# Altium schematic sheet Glucometer-I.C.- Tests Full V1.SchDoc
size A4; PageSetup: Record=PageOptions|CenterHorizontal=True|CenterVertical=True|PrintScale=0.91|XCorrection=1.00|YCorrection=1.00|PrintKind=1|BorderSize=5000000|LeftOffset=0|BottomOffset=0|Orientation=2|PaperLength=1000|PaperWidth=1000|Scale=100|PaperSource=7|PrintQuality=-4|MediaType=1|DitherType=10|PaperKind=Carta|PrintScaleMode=1
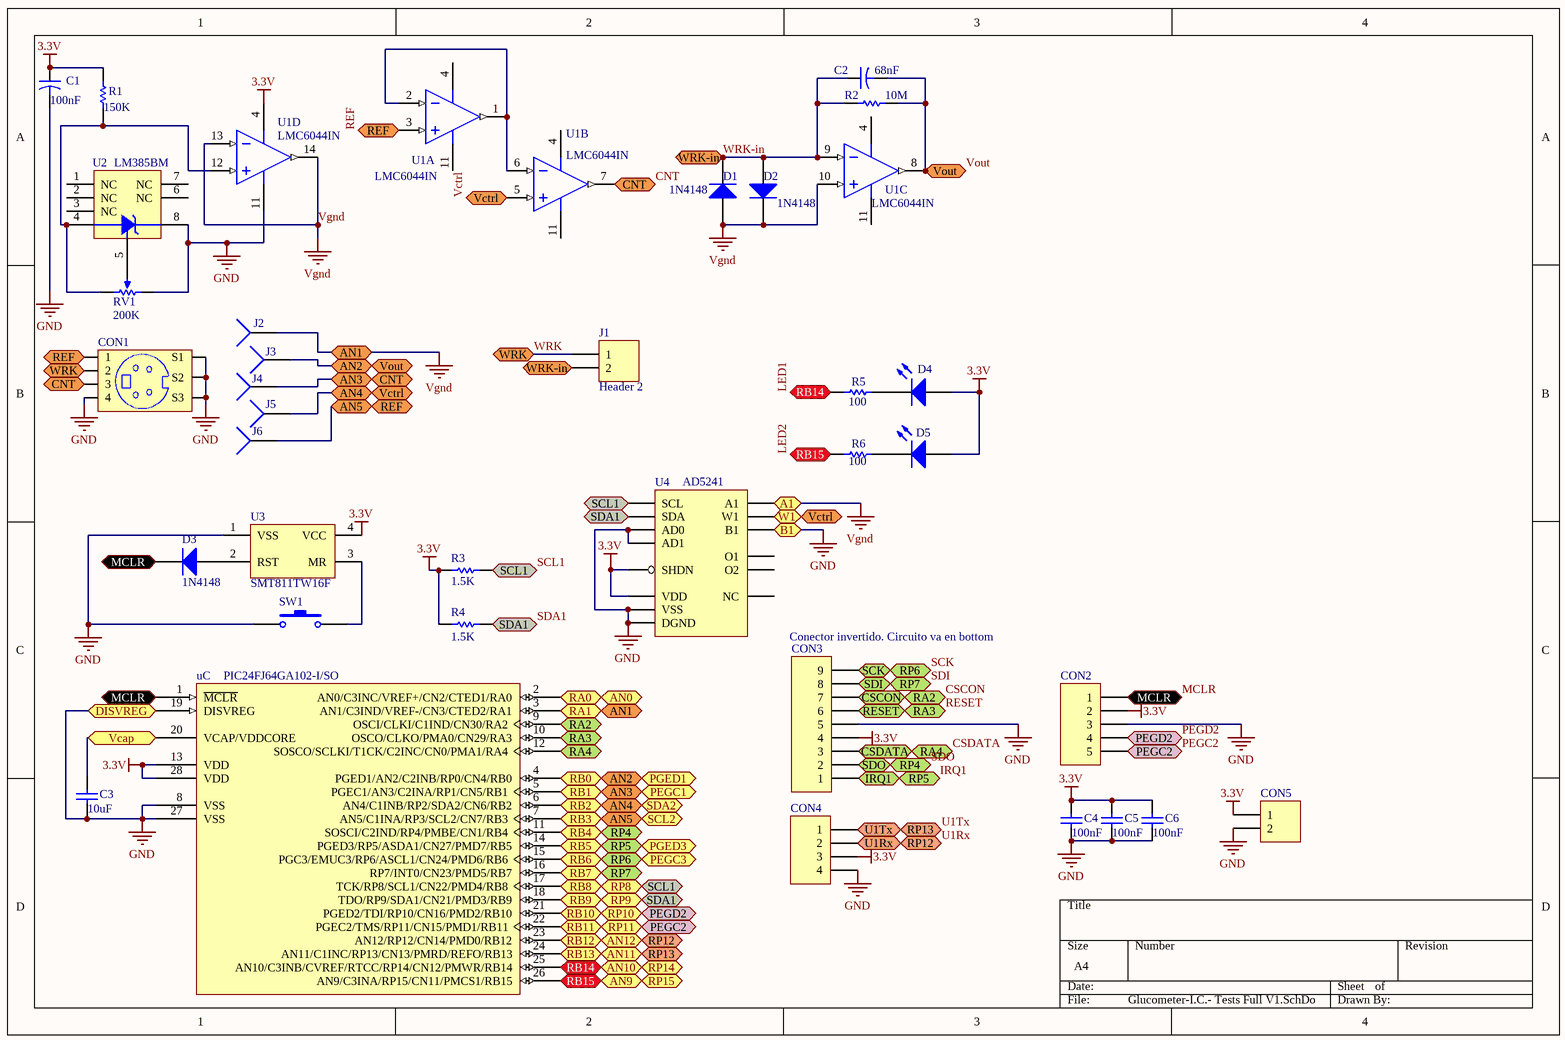
[diagram p0: Glucometer-I.C.- Tests Full V1.SchDoc]

## Parts
C1  value 100nF  [CAPC1608N]  (hidden comment: Cap2)
C2  value 68nF  [CAPC1608N]  (hidden comment: Cap2)
C3  value 10uF  [CAPC2012N]  (hidden comment: Cap)
C4  value 100nF  [CAPC1608N]  (hidden comment: Cap)
C5  value 100nF  [CAPC1608N]  (hidden comment: Cap)
C6  value 100nF  [CAPC1608N]  (hidden comment: Cap)
CON1  (no value)  [CDIN2.6-3H4A]
CON2  Header 5  [HDR1X5]  (value not drawn)
CON3  Header 9  [HDR1X9]  (value not drawn)
CON4  Header 4  [HDR1X4]  (value not drawn)
CON5  Header 2  [HDR1X2]  (value not drawn)
D1  1N4148  [CD3216-1206]
D2  1N4148  [CD3216-1206]
D3  1N4148  [DO-35]
D4  LED2  [3.2X1.6X1.1]  (value not drawn)
D5  LED2  [3.2X1.6X1.1]  (value not drawn)
J1  Header 2  [HDR1X2]
J2  Socket  [PIN1]  (value not drawn)
J3  Socket  [PIN1]  (value not drawn)
J4  Socket  [PIN1]  (value not drawn)
J5  Socket  [PIN1]  (value not drawn)
J6  Socket  [PIN1]  (value not drawn)
R1  value 150K  [RESC2012N]  (hidden comment: Res1)
R2  value 10M  [RESC2012N]  (hidden comment: Res1)
R3  value 1.5K  [RESC2012N]  (hidden comment: Res1)
R4  value 1.5K  [RESC2012N]  (hidden comment: Res1)
R5  value 100  [RESC2012N]  (hidden comment: Res1)
R6  value 100  [RESC2012N]  (hidden comment: Res1)
RV1  value 200K  [SOT23-3N]  (hidden comment: RPot)
SW1  SW-PB  [SPST-2]  (value not drawn)
U1  LMC6044IN  [M14A_N]  (parts A,B,C,D of 4)
U2  LM385BM  [M08A_N]
U3  SMT811TW16F  [SOT143]
U4  AD5241  [R-14_N]
uC  PIC24FJ64GA102-I/SO  [SOIC-SO28_N]

## Ports
A1, AN0, AN1, AN2, AN3, AN4, AN5, AN9, AN10, AN11, AN12, B1, CNT, CSCON, CSDATA, DISVREG, IRQ1, MCLR, PEGC1, PEGC2, PEGC3, PEGD2, PGED1, PGED3, RA0, RA1, RA2, RA3, RA4, RB0, RB1, RB2, RB3, RB4, RB5, RB6, RB7, RB8, RB9, RB10, RB11, RB12, RB13, RB14, RB15, REF, RESET, RP4, RP5, RP6, RP7, RP8, RP9, RP10, RP11, RP12, RP13, RP14, RP15, SCK, SCL1, SCL2, SDA1, SDA2, SDI, SDO, U1Rx, U1Tx, Vcap, Vctrl, Vout, W1, WRK, WRK-in

## Nets
3.3V: C1.1 C4.2 C5.2 C6.2 CON2.2 CON3.4 CON4.3 CON5.1 D4.1(A) D5.1(A) R1.2 R3.1 R4.1 U1.4(V+) U3.4(VCC) U4.4(VDD) U4.5(SHDN) uC.13(VDD) uC.28(VDD)
GND: C1.2 C3.1 C4.1 C5.1 C6.1 CON1.4 CON1.MH1(S1) CON1.MH2(S2) CON1.MH3(S3) CON2.3 CON3.5 CON4.4 CON5.2 RV1.1(TOP) SW1.1 U1.11(V-) U2.8(+V) U3.1(VSS) U4.3(B1) U4.8(AD0) U4.9(AD1) U4.10(DGND) U4.11(VSS) uC.8(VSS) uC.19(DISVREG) uC.27(VSS) ; port DISVREG, port B1
Vgnd: D1.1(A) D2.2(K) J2.1 U1.10(IN3+) U1.13(IN4-) U1.14(OUT4) U4.1(A1) uC.3(AN1/C3IND/VREF-/CN3/CTED2/RA1) ; port RA1, port AN1, port A1
AN0: uC.2(AN0/C3INC/VREF+/CN2/CTED1/RA0) ; port RA0, port AN0
CNT: CON1.3 J4.1 U1.7(OUT2) uC.5(PGEC1/AN3/C2INA/RP1/CN5/RB1) ; port CNT, port RB1, port AN3, port PEGC1
CSCON: CON3.7 uC.9(OSCI/CLKI/C1IND/CN30/RA2) ; port CSCON, port RA2
CSDATA: CON3.3 uC.12(SOSCO/SCLKI/T1CK/C2INC/CN0/PMA1/RA4) ; port RA4, port CSDATA
IRQ1: CON3.1 uC.14(PGED3/RP5/ASDA1/CN27/PMD7/RB5) ; port RP5, port PGED3, port RB5, port IRQ1
LED1: R5.1 uC.25(AN10/C3INB/CVREF/RTCC/RP14/CN12/PMWR/RB14) ; port RB14, port AN10, port RP14
LED2: R6.1 uC.26(AN9/C3INA/RP15/CN11/PMCS1/RB15) ; port RB15, port AN9, port RP15
MCLR: CON2.1 D3.2(K) uC.1(~{MCLR}) ; port MCLR
PEGC2: CON2.5 uC.22(PGEC2/TMS/RP11/CN15/PMD1/RB11) ; port RB11, port RP11, port PEGC2
PEGD2: CON2.4 uC.21(PGED2/TDI/RP10/CN16/PMD2/RB10) ; port RB10, port RP10, port PEGD2
REF: CON1.1 J6.1 U1.3(IN1+) uC.7(AN5/C1INA/RP3/SCL2/CN7/RB3) ; port REF, port RB3, port AN5, port SCL2
RESET: CON3.6 uC.10(OSCO/CLKO/PMA0/CN29/RA3) ; port RA3, port RESET
SCK: CON3.9 uC.15(PGC3/EMUC3/RP6/ASCL1/CN24/PMD6/RB6) ; port RP6, port PEGC3, port SCK, port RB6
SCL1: R3.2 U4.6(SCL) uC.17(TCK/RP8/SCL1/CN22/PMD4/RB8) ; port RB8, port SCL1, port RP8
SDA1: R4.2 U4.7(SDA) uC.18(TDO/RP9/SDA1/CN21/PMD3/RB9) ; port RB9, port SDA1, port RP9
SDI: CON3.8 uC.16(RP7/INT0/CN23/PMD5/RB7) ; port RP7, port SDI, port RB7
SDO: CON3.2 uC.11(SOSCI/C2IND/RP4/PMBE/CN1/RB4) ; port SDO, port RB4, port RP4
U1Rx: CON4.2 uC.23(AN12/RP12/CN14/PMD0/RB12) ; port RB12, port AN12, port RP12, port U1Rx
U1Tx: CON4.1 uC.24(AN11/C1INC/RP13/CN13/PMRD/REFO/RB13) ; port RB13, port AN11, port RP13, port U1Tx
Vcap: C3.2 uC.20(VCAP/VDDCORE) ; port Vcap
Vctrl: J5.1 U1.5(IN2+) U4.2(W1) uC.6(AN4/C1INB/RP2/SDA2/CN6/RB2) ; port Vctrl, port RB2, port AN4, port SDA2, port W1
Vout: C2.2 J3.1 R2.1 U1.8(OUT3) uC.4(PGED1/AN2/C2INB/RP0/CN4/RB0) ; port Vout, port RB0, port AN2, port PGED1
WRK: CON1.2 J1.1 ; port WRK
WRK-in: C2.1 D1.2(K) D2.1(A) J1.2 R2.2 U1.9(IN3-) ; port WRK-in
NetD3_1: D3.1(A) U3.2(RST)
NetD4_2: D4.2(K) R5.2
NetD5_2: D5.2(K) R6.2
NetR1_1: R1.1 RV1.2(BOT) U1.12(IN4+) U2.4(-V)
NetRV1_3: RV1.3(TAP) U2.5(FB)
NetSW1_2: SW1.2 U3.3(MR)
NetU1_1: U1.1(OUT1) U1.2(IN1-) U1.6(IN2-)

Not connected (* = marked no-connect by the designer): U2 1(NC) 2(NC) 3(NC) 6(NC) 7(NC); U4 12(O2) 13(NC) 14(O1)

## Notes on the sheet
- Conector invertido. Circuito va en bottom

## Library data of the parts
C1 C2 = Cap2: Capacitor; Published: 23-Sep-2002; PackageReference: CAPR5-4X5; Publisher: Altium Limited; PackageDescription: Capacitor; 2 Leads
C3-C6 = Cap: Capacitor; Published: 8-Jun-2000; LatestRevisionDate: 17-Jul-2002; LatestRevisionNote: Re-released for DXP Platform.; PackageReference: RAD-0.3; Publisher: Altium Limited; PackageDescription: Radial Cap, Thru-Hole; 2 Leads; 0.3 in Pin Spacing
CON1 = MiniDin 4Pins - SuperVideo: MiniDin 4 Pins
CON2 = Header 5: Header, 5-Pin; LatestRevisionDate: 17-Jul-2002; LatestRevisionNote: Re-released for DXP Platform.; Publisher: Altium Limited
CON3 = Header 9: Header, 9-Pin; LatestRevisionDate: 17-Jul-2002; LatestRevisionNote: Re-released for DXP Platform.; Publisher: Altium Limited
CON4 = Header 4: Header, 4-Pin; LatestRevisionDate: 17-Jul-2002; LatestRevisionNote: Re-released for DXP Platform.; Publisher: Altium Limited
CON5 J1 = Header 2: Header, 2-Pin; LatestRevisionDate: 17-Jul-2002; LatestRevisionNote: Re-released for DXP Platform.; Publisher: Altium Limited
D1-D3 = 1N4148: High Conductance Fast Diode; Published: 8-Jun-2000; LatestRevisionDate: 17-Jul-2002; LatestRevisionNote: Re-released for DXP Platform.; DatasheetDocument: 1997; PackageReference: DO-35; Publisher: Altium Limited; Code_JEDEC: DO-204-AH; ComponentLink1Description: Manufacturer Link; ComponentLink1URL: http://www.fairchildsemi.com/; ComponentLink2Description: Datasheet; ComponentLink2URL: http://www.fairchildsemi.com/ds/1N%2F1N4148.pdf
D4 D5 = LED2: Typical RED, GREEN, YELLOW, AMBER GaAs LED; Published: 8-Jun-2000; LatestRevisionDate: 17-Jul-2002; LatestRevisionNote: Re-released for DXP Platform.; PackageVersion: Feb-2002; PackageReference: 3.2X1.6X1.1; Publisher: Altium Limited; PackageDescription: SM LED; 2 Flat Leads
R1-R6 = Res1: Resistor; Published: 8-Jun-2000; LatestRevisionDate: 17-Jul-2002; LatestRevisionNote: Re-released for DXP Platform.; PackageReference: AXIAL-0.3; Publisher: Altium Limited; PackageDescription: Axial Device, Thru-Hole; 2 Leads; 0.3 in Pin Spacing
RV1 = RPot: Potentiometer; pin to pad: 2>3 3>2; Sim Note: Enter the Resistance value and the set point into parameter fields.; Set Position: 0.5; Published: 8-Jun-2000; LatestRevisionDate: 17-Jul-2002; LatestRevisionNote: Re-released for DXP Platform.; PackageReference: VR5; Publisher: Altium Limited; PackageDescription: Variable Resistor, Thru-Hole; 3 Leads
SW1 = SW-PB: Switch; Published: 24-Mar-1999; LatestRevisionDate: 17-Jul-2002; LatestRevisionNote: Re-released for DXP Platform.; PackageReference: SPST-2; Publisher: Altium Limited; PackageDescription: Switch; 2 Leads
U1 = LMC6044IN: CMOS Quad Micropower Operational Amplifier, 14-pin MDIP; Manufacturer: National Semiconductor; PackageTopMarking: NSUZXYYTTE#*LMC6044IN; PowerWise: Y; CompType: Amplifiers; Published: 4-Dec-2008; LatestRevisionDate: 13-Jan-2009; LatestRevisionNote: Sim Model Added.; DatasheetVersion: Aug-2000; PackageVersion: revG, May-2006; PackageReference: N14A; Publisher: Altium Limited; PackageDescription: MDIP, .750 x .250 x.130in, 14 Lead, .100in Pitch; Supplier 1: Farnell; Supplier Part Number 1: 9494634; PartNumber: LMC6044IN; RoHS: N; PinCount: 14; Code_JEDEC: MS-001-AA; ComponentLink1Description: LMC6044 Datasheet; ComponentLink1URL: http://www.national.com/ds/LM/LMC6044.pdf; ComponentLink2Description: LMC6044 Web Page; ComponentLink2URL: http://www.national.com/pf/LM/LMC6044.html; ComponentLink3Description: N14A Package Page; ComponentLink3URL: http://www.national.com/packaging/folders/n14a.html
U2 = LM385BM: Adjustable Micropower Voltage Reference, 8-pin Narrow SOIC; Manufacturer: National Semiconductor; PackageTopMarking: NSZXTT*LM385*BM; PowerWise: N; CompType: Voltage Reference IC; Published: 4-Dec-2008; DatasheetVersion: Jan-2008; PackageVersion: revM, May-2009; PackageReference: M08A; Publisher: Altium Limited; PackageDescription: SOIC Narrow, 4.9 x 3.9 x 1.45mm, 8 Lead, 1.27mm Pitch; Supplier 1: Farnell; Supplier Part Number 1: 953817; PartNumber: LM385BM; RoHS: N; PinCount: 8; Code_JEDEC: MS-012-AA; Code_IPC: SOIC127P600-8; ComponentLink1Description: LM385-ADJ Datasheet; ComponentLink1URL: http://www.national.com/ds/LM/LM385-ADJ.pdf; ComponentLink2Description: LM385-ADJ Web Page; ComponentLink2URL: http://www.national.com/pf/LM/LM385-ADJ.html; ComponentLink3Description: M08A Package Page; ComponentLink3URL: http://www.national.com/packaging/folders/m08a.html
U3 = SMT811TW16F: Reset Circuit, 3.08V, Push Pull Inverted RST
U4 = AD5241: AD5241BR
uC = PIC24FJ64GA102-I/SO: General purpose 16-bit Flash Microcontroller with nanoWatt XLP, 64KB Flash, 8KB SRAM, 28-Pin SOIC, Industrial Temperature; Published: 2-Dec-2009; LatestRevisionDate: 07-Oct-2010; LatestRevisionNote: Updated to datasheet revision C, Aug-2010. Supplier links updated. Sch. pin 7 name corrected.; DatasheetVersion: revC, Aug-2010; PackageVersion: revBB, Aug-2009; PackageReference: SOIC-SO28; Publisher: Altium Limited; PackageDescription: 28-Lead Plastic Small Outline (SO) - Wide 7.50mm Body [SOIC]; Supplier 1: Digi-Key; Supplier Part Number 1: PIC24FJ64GA102-I/SO-ND; Supplier 2: Farnell; Supplier Part Number 2: 1778478; Code_JEDEC: MS-013; ComponentLink1Description: Datasheet; ComponentLink1URL: http://ww1.microchip.com/downloads/en/DeviceDoc/39951C.pdf; ComponentLink2Description: Packaging Specification; ComponentLink2URL: http://www.microchip.com/stellent/groups/techpub_sg/documents/packagingspec/en012702.pdf; ComponentLink3Description: Microchip.com Home; ComponentLink3URL: http://www.microchip.com/
J2-J6 = Socket: LatestRevisionDate: 17-Jul-2002; LatestRevisionNote: Re-released for DXP Platform.; Publisher: Altium Limited